# EasyEDA Pro project mbot_command_link.epro

# Schematic MBot_Wireless_Host_V1.1

## Sheets
1 MCU
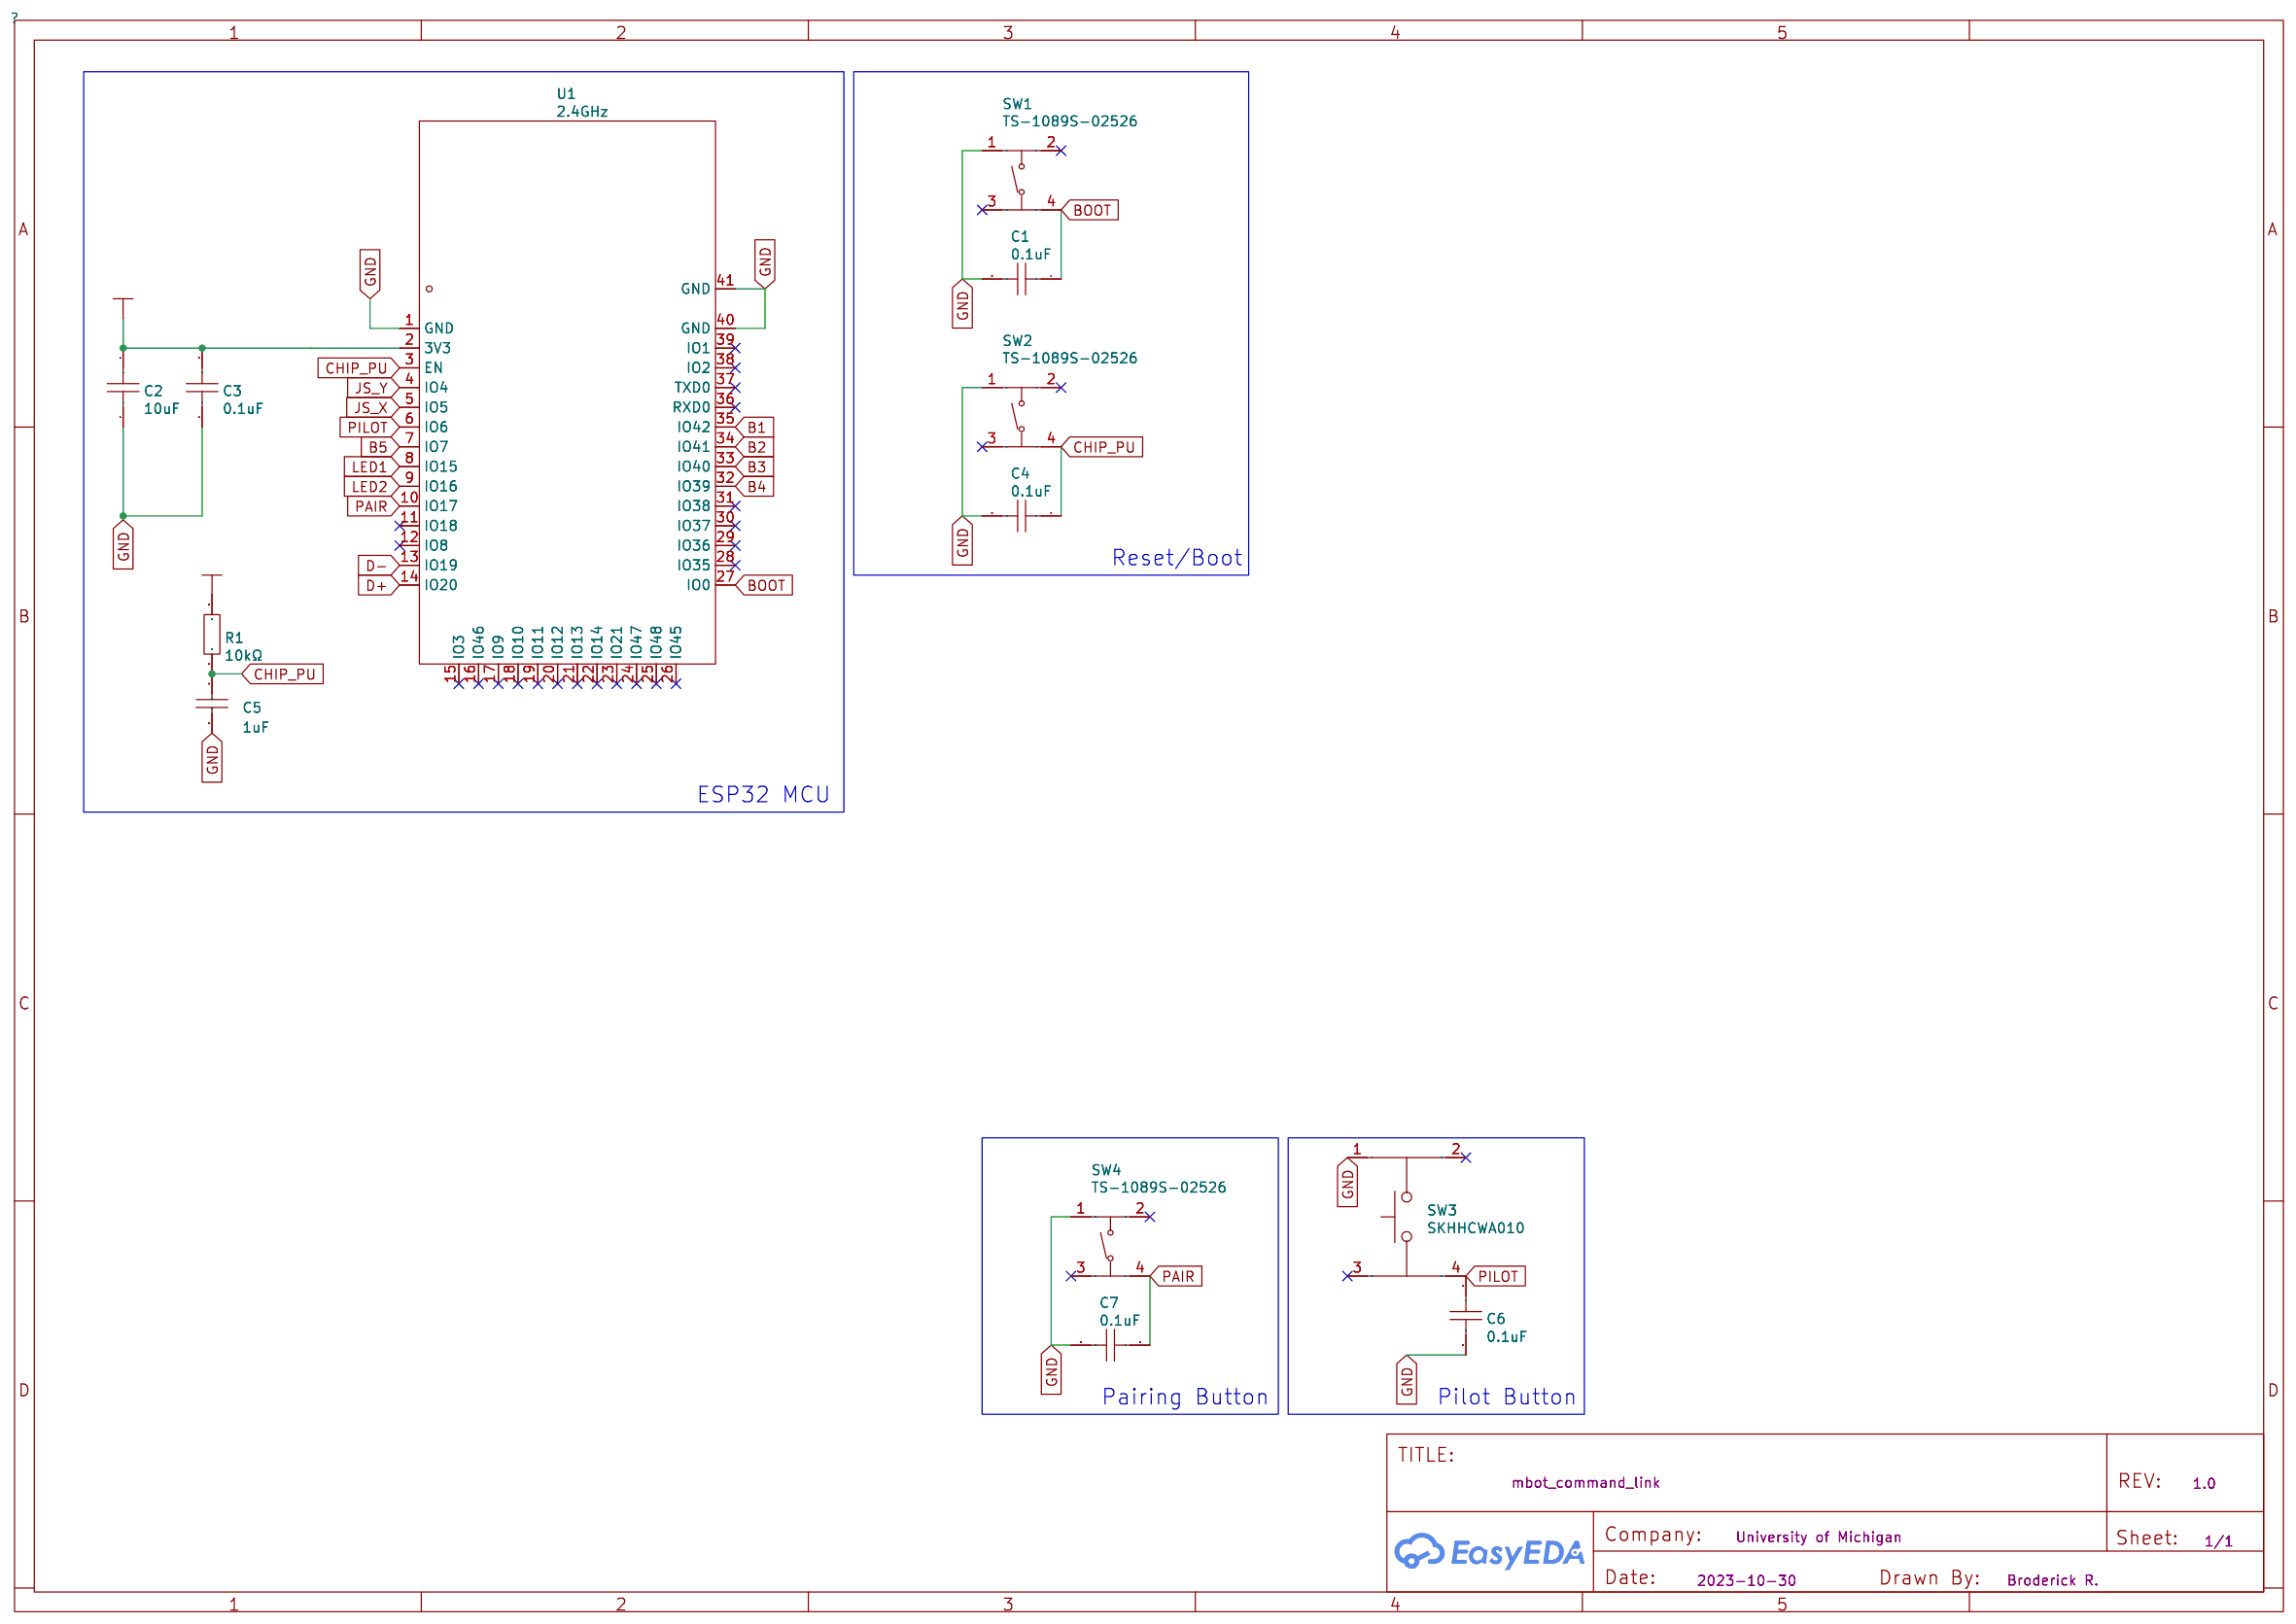
[diagram p0: MCU]
2 Power: Create Date: 2024-04-29; Page Name: Power; Project Name: MBot_Wireless_Host_V1.1_Pro; Schematic Name: MBot_Wireless_Host_V1.1; Update Date: 2024-04-29; Company: EasyEDA.com; Drawn: EasyEDA; Page Size: A4; Part Number: JLCPCB-002; Reviewed: EasyEDA; Version: V0.1
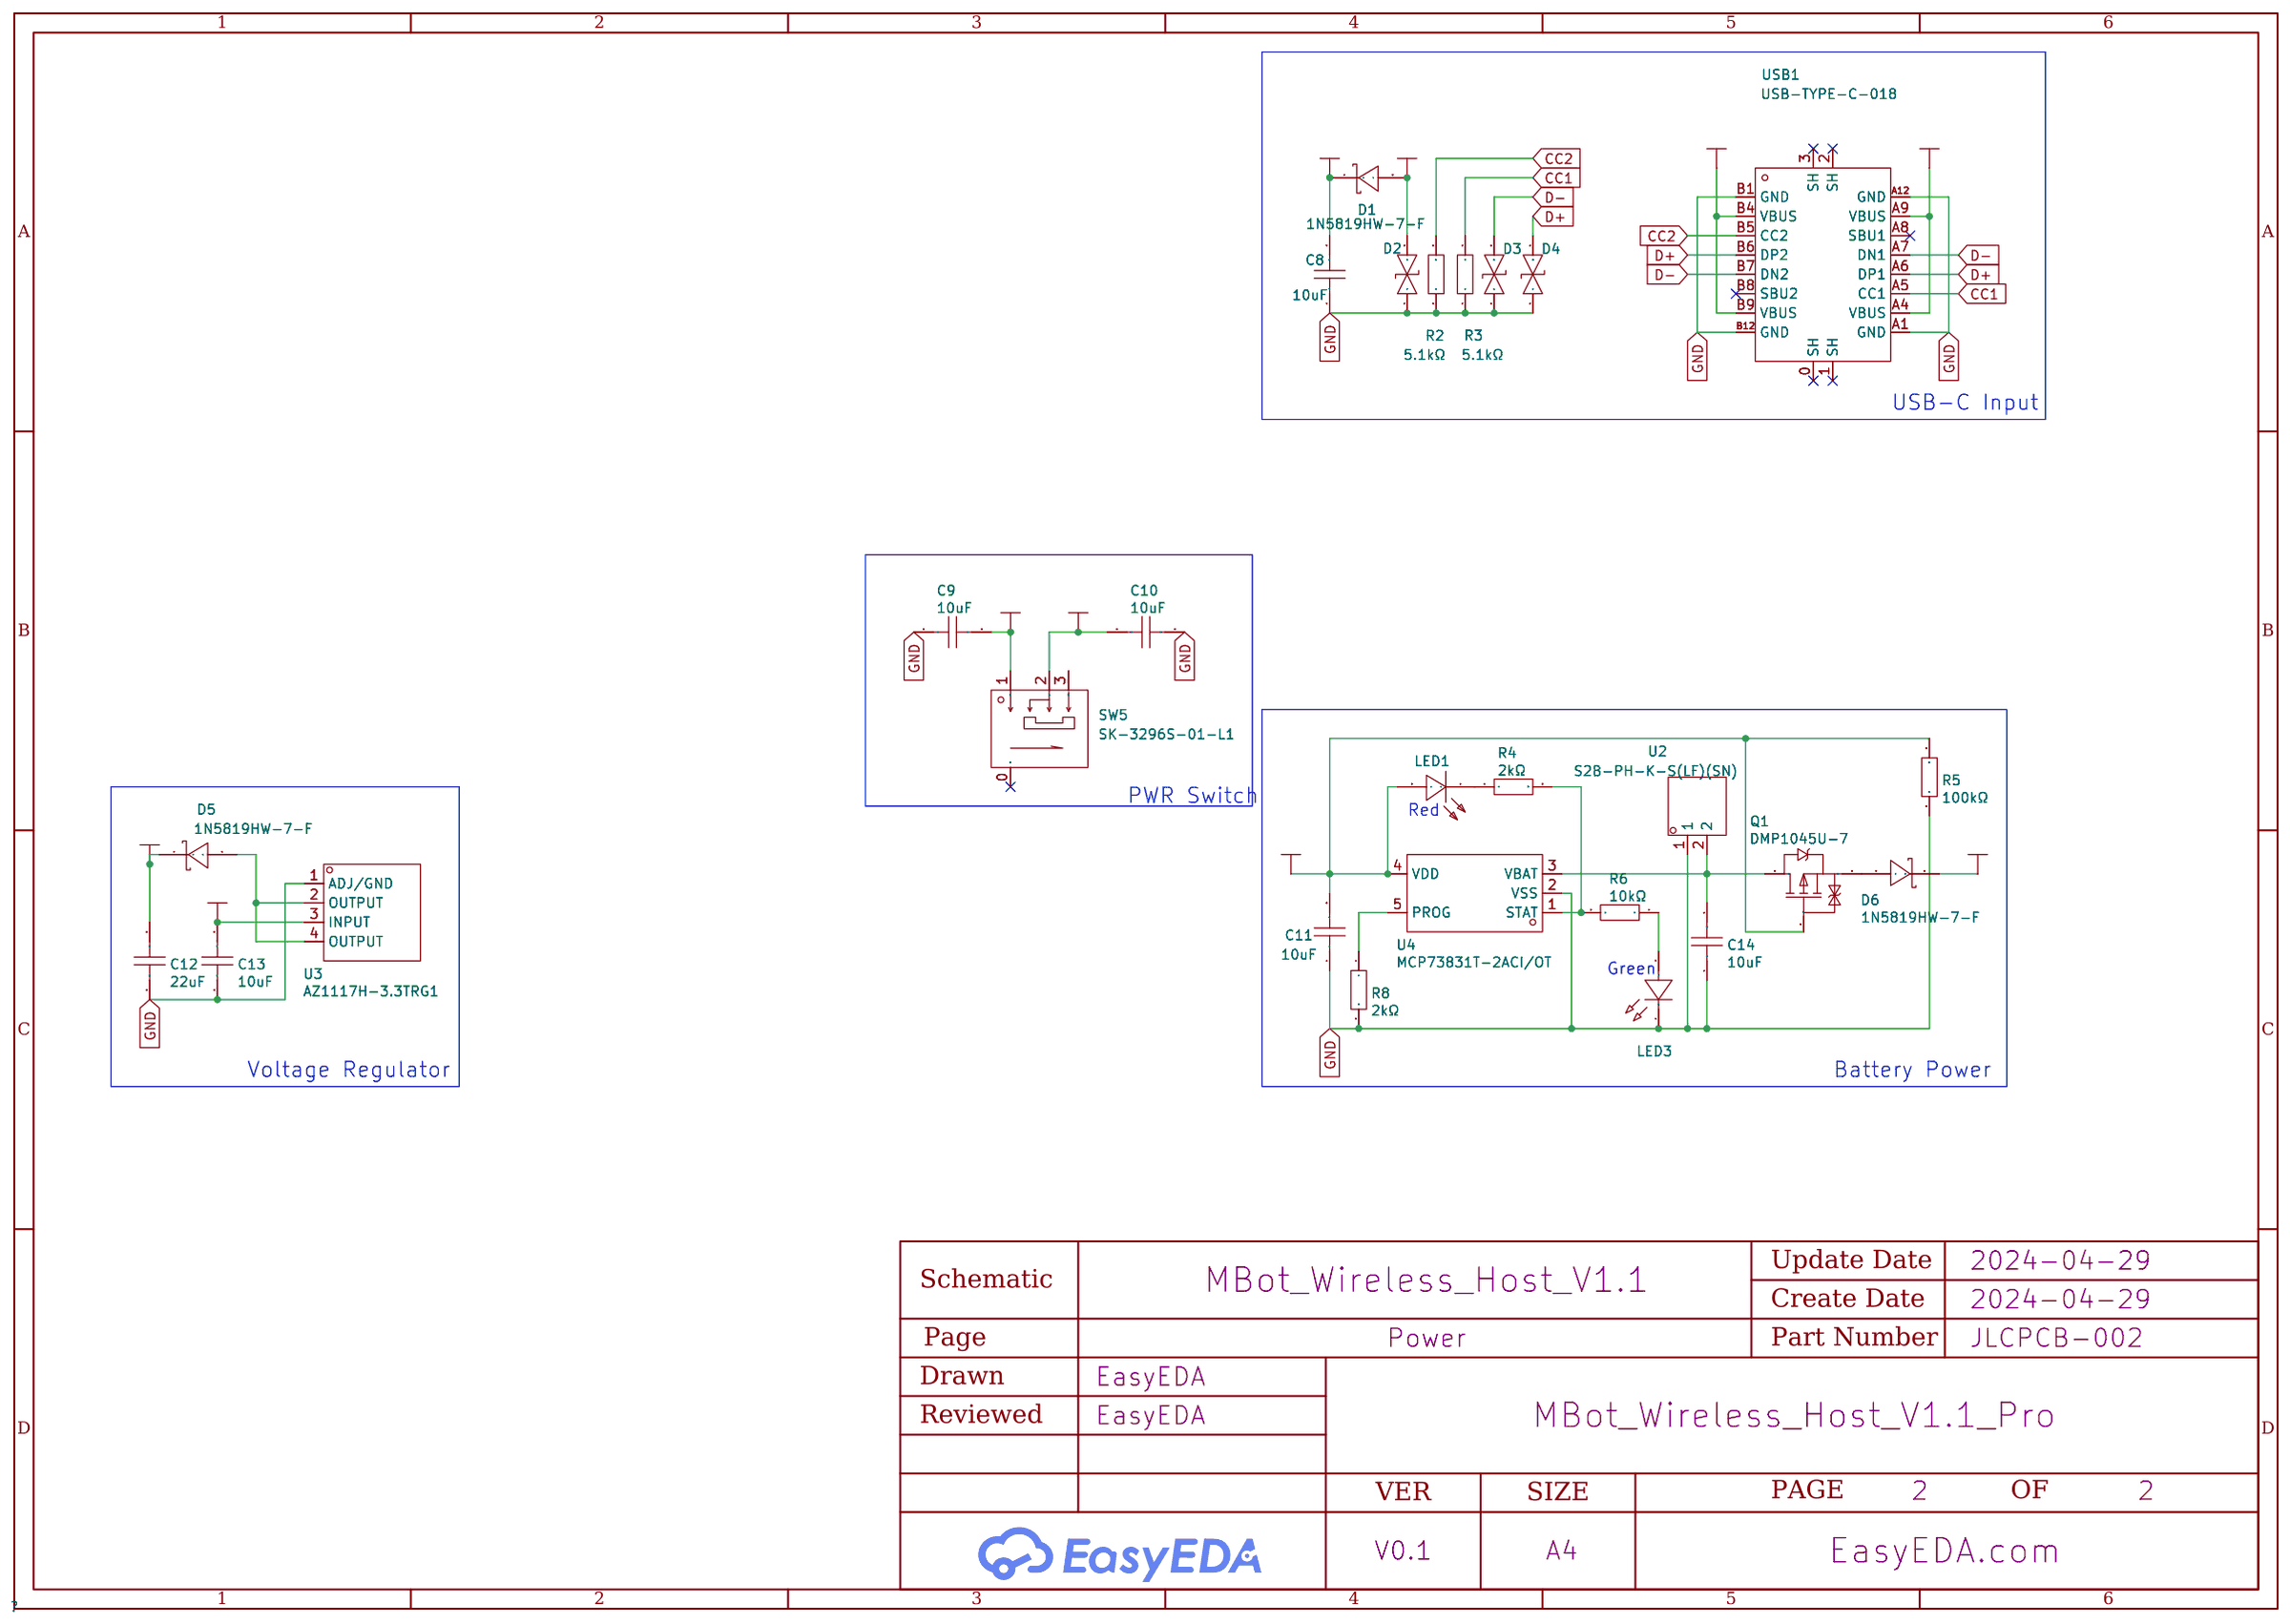
[diagram p1: Power]
3 UI: Create Date: 2024-04-29; Page Name: UI; Project Name: mbot_command_link; Schematic Name: MBot_Wireless_Host_V1.1; Update Date: 2024-05-23; Company: EasyEDA.com; Drawn: EasyEDA; Page Size: A4; Part Number: JLCPCB-002; Reviewed: EasyEDA; Version: V0.1
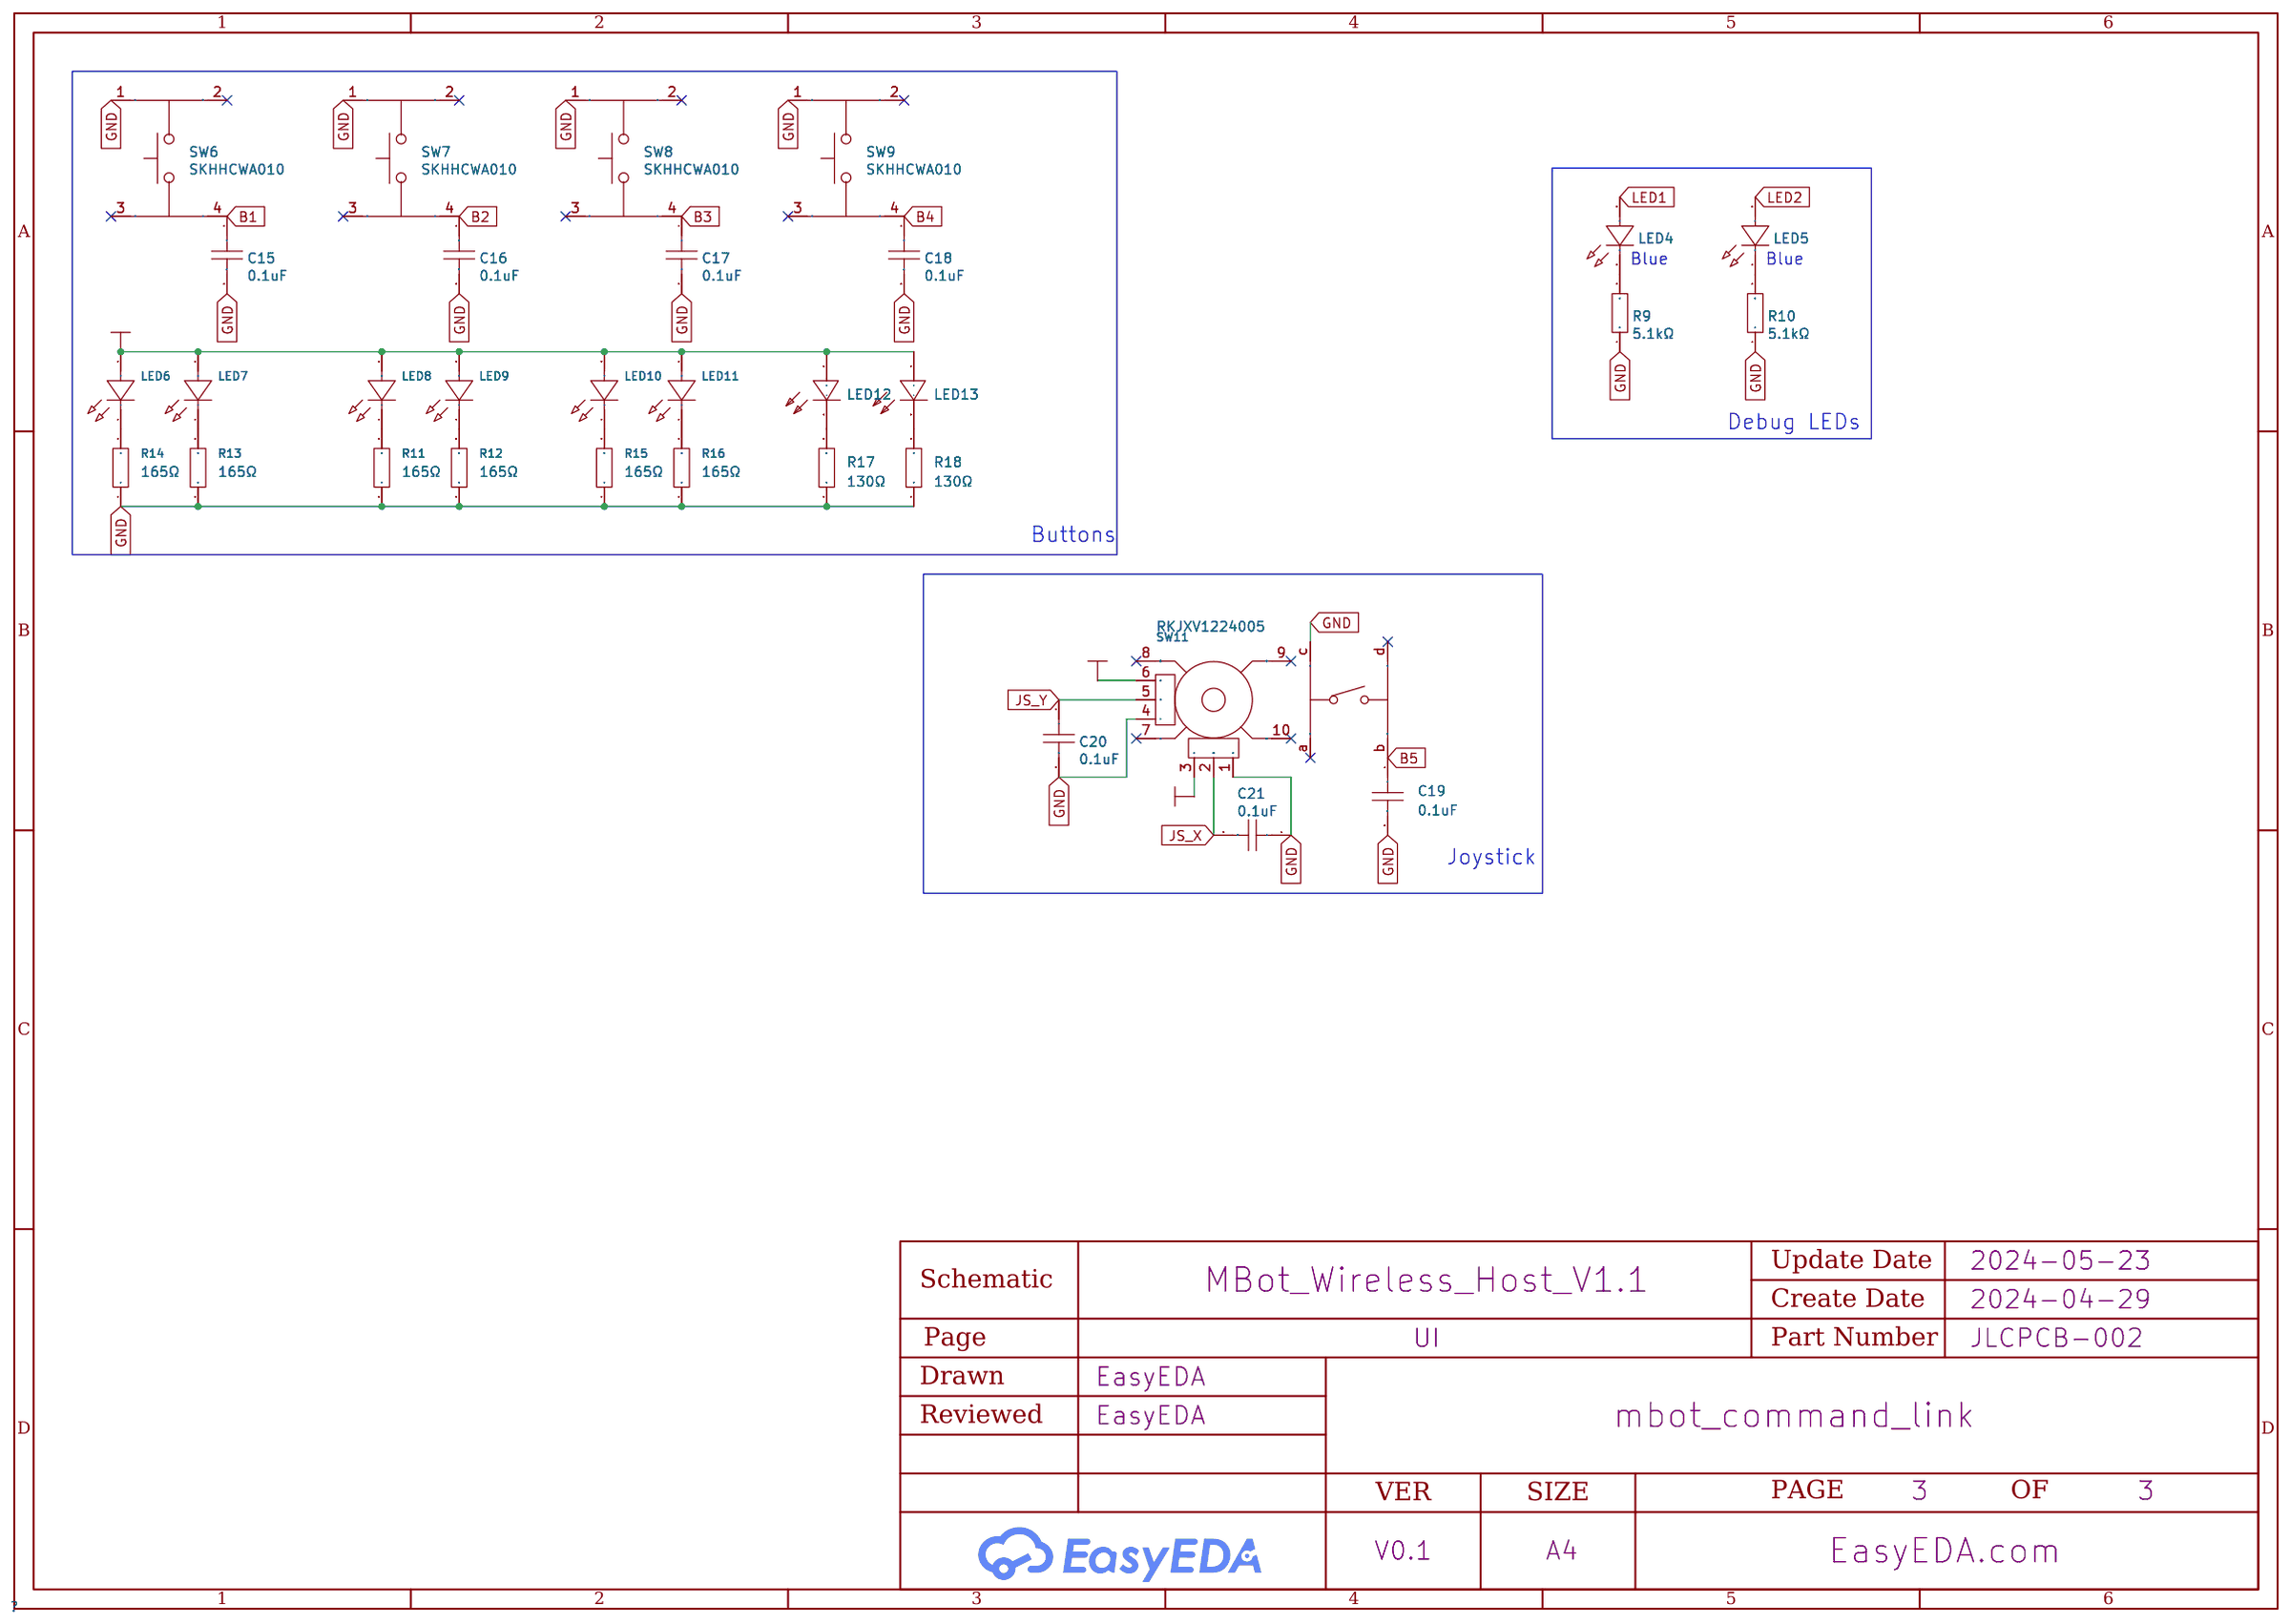
[diagram p2: UI]

## Parts
sheet MCU
C1  0.1uF  [footprint_52c0]
C2  10uF  [footprint_52c0]
C3  0.1uF  [footprint_52c0]
C4  0.1uF  [footprint_52c0]
C5  1uF  [C0603]
C6  0.1uF  [footprint_52c0]
C7  0.1uF  [footprint_52c0]
R1  10kΩ  [footprint_0432]
SW1  TS-1089S-02526  [footprint_4ab8]
SW2  TS-1089S-02526  [footprint_4ab8]
SW3  SKHHCWA010  [footprint_5a2e]
SW4  TS-1089S-02526  [footprint_4ab8]
U1  2.4GHz  [WIRELM-SMD_ESP32-S3-WROOM-1]
sheet Power
C8  10uF  [footprint_52c0]
C9  10uF  [footprint_52c0]
C10  10uF  [footprint_52c0]
C11  10uF  [footprint_52c0]
C12  22uF  [footprint_52c0]
C13  10uF  [footprint_52c0]
C14  10uF  [footprint_52c0]
D1  1N5819HW-7-F  [footprint_34dc]
D2  LESD5D5.0CT1G  [footprint_baa1]
D3  LESD5D5.0CT1G  [footprint_baa1]
D4  LESD5D5.0CT1G  [footprint_baa1]
D5  1N5819HW-7-F  [footprint_34dc]
D6  1N5819HW-7-F  [footprint_34dc]
LED1  KT-0603R  [footprint_1124]
LED3  XL-1608UGC-04  [footprint_5fac]
Q1  DMP1045U-7  [footprint_aab3]
R2  5.1kΩ  [footprint_0432]
R3  5.1kΩ  [footprint_0432]
R4  2kΩ  [footprint_0432]
R5  100kΩ  [footprint_0432]
R6  10kΩ  [footprint_0432]
R8  2kΩ  [footprint_0432]
SW5  SK-3296S-01-L1  [SW-SMD_3P-P1.50_L2.7-W6.6]
U2  S2B-PH-K-S(LF)(SN)  [footprint_2180]
U3  AZ1117H-3.3TRG1  [footprint_7102]
U4  MCP73831T-2ACI/OT  [footprint_d70e]
USB1  USB-TYPE-C-018  [footprint_530a]
sheet UI
C15  0.1uF  [footprint_52c0]
C16  0.1uF  [footprint_52c0]
C17  0.1uF  [footprint_52c0]
C18  0.1uF  [footprint_52c0]
C19  0.1uF  [footprint_52c0]
C20  0.1uF  [footprint_52c0]
C21  0.1uF  [footprint_52c0]
LED4  XL-1608UBC-04  [LED0603-RD_BLUE]
LED5  XL-1608UBC-04  [LED0603-RD_BLUE]
LED6  XL-1608UYC-06  [LED0603-RD-YELLOW]
LED7  XL-1608UYC-06  [LED0603-RD-YELLOW]
LED8  XL-1608SURC-06  [LED0603-RD_RED]
LED9  XL-1608SURC-06  [LED0603-RD_RED]
LED10  XL-1608UGC-04  [LED0603-RD_GREEN]
LED11  XL-1608UGC-04  [LED0603-RD_GREEN]
LED12  19-218/BHC-ZL1M2QY/3T  [LED0603-R-RD_BLUE]
LED13  19-218/BHC-ZL1M2QY/3T  [LED0603-R-RD_BLUE]
R9  5.1kΩ  [footprint_0432]
R10  5.1kΩ  [footprint_0432]
R11  165Ω  [R0603]
R12  165Ω  [R0603]
R13  165Ω  [R0603]
R14  165Ω  [R0603]
R15  165Ω  [R0603]
R16  165Ω  [R0603]
R17  130Ω  [R0603]
R18  130Ω  [R0603]
SW6  SKHHCWA010  [footprint_5a2e]
SW7  SKHHCWA010  [footprint_5a2e]
SW8  SKHHCWA010  [footprint_5a2e]
SW9  SKHHCWA010  [footprint_5a2e]
SW11  RKJXV1224005  [SW-TH_RKJXV1224005]

## Library data of the parts
C1 C3 C4 C6 C7 C15-C21 = 0.1uF: Supplier: LCSC; Manufacturer: YAGEO(国巨); Manufacturer Part: CC0603KRX7R9BB104; Supplier Part: C14663; JLCPCB Part Class: Basic Part; link: https://lcsc.com/eda_search?q=C14663&amp;%26type=1&amp;ref=editor
C2 C8-C11 C13 C14 = 10uF: Supplier: LCSC; Manufacturer: SAMSUNG(三星); Manufacturer Part: CL10A106KP8NNNC; Supplier Part: C19702; JLCPCB Part Class: Basic Part; link: https://lcsc.com/eda_search?q=C19702&amp;%26type=1&amp;ref=editor
C5 = CL10A105KO8NNNC: Capacitance: Tolerance:±10% Tolerance:±10% Voltage Rated: Temperature Coefficient:; LCSC Part Name: 1uF ±10% 16V; Supplier Part: C1592; Manufacturer: SAMSUNG(三星); Supplier Footprint: 0603; Datasheet: https://atta.szlcsc.com/upload/public/pdf/source/20220919/9FBE606BE0D9532D730F292EB26DC5BB.pdf; Supplier: LCSC; Tolerance: ±10%
R1 R6 = 10kΩ: Supplier: LCSC; Manufacturer: UNI-ROYAL(厚声); Manufacturer Part: 0603WAF1002T5E; Supplier Part: C25804; JLCPCB Part Class: Basic Part; link: https://lcsc.com/eda_search?q=C25804&amp;%26type=1&amp;ref=editor
SW1 SW2 SW4 = TS-1089S-02526: Supplier: LCSC; Supplier Part: C455282; Manufacturer: XUNPU(讯普); JLCPCB Part Class: Extended Part
SW3 SW6-SW9 = SKHHCWA010: Supplier: LCSC; Supplier Part: C139761; Manufacturer: ALPSALPINE(阿尔卑斯阿尔派); JLCPCB Part Class: Extended Part; link: https://lcsc.com/eda_search?q=C139761&amp;%26type=1&amp;ref=editor
U1 = ESP32-S3-WROOM-1-N8R2: Core Processor:ESP32-S3芯片 Support Interface:I2C；GPIO；SPI；PWM；ADC；UART；USB；I2S Frequency:2.4GHz; LCSC Part Name: 通用型Wi-Fi+低功耗蓝牙MCU模组; Supplier Part: C2913204; Manufacturer: ESPRESSIF(乐鑫); Supplier Footprint: SMD,18x25.5mm; JLCPCB Part Class: Extended Part; Datasheet: https://atta.szlcsc.com/upload/public/pdf/source/20220628/A2AC12B3C87735CAEB7EBE2DBE80936C.pdf; Supplier: LCSC; Core Processor: ESP32-S3芯片; Support Interface: I2C；GPIO；SPI；PWM；ADC；UART；USB；I2S
C12 = 22uF: Supplier: LCSC; Manufacturer: SAMSUNG(三星); Manufacturer Part: CL10A226MQ8NRNC; Supplier Part: C59461; JLCPCB Part Class: Basic Part; link: https://lcsc.com/eda_search?q=C59461&amp;%26type=1&amp;ref=editor
D1 D5 D6 = 1N5819HW-7-F: Supplier: LCSC; Manufacturer: DIODES(美台); Supplier Part: C82544; JLCPCB Part Class: Extended Part; link: https://lcsc.com/eda_search?q=C82544&amp;%26type=1&amp;ref=editor
D2-D4 = LESD5D5.0CT1G: Supplier: LCSC; Supplier Part: C383211; Manufacturer: LRC(乐山无线电); JLCPCB Part Class: Extended Part; link: https://lcsc.com/eda_search?q=C383211&amp;%26type=1&amp;ref=editor
LED1 = KT-0603R: Supplier: LCSC; Manufacturer: KENTO; Supplier Part: C2286; JLCPCB Part Class: Basic Part; link: https://lcsc.com/eda_search?q=C2286&amp;%26type=1&amp;ref=editor
LED3 = XL-1608UGC-04: Supplier: LCSC; Supplier Part: C965804; Manufacturer: XINGLIGHT(成兴光); JLCPCB Part Class: Extended Part
Q1 = DMP1045U-7: Supplier: LCSC; Supplier Part: C177033; Manufacturer: DIODES(美台); JLCPCB Part Class: Extended Part; link: https://lcsc.com/eda_search?q=C177033&amp;%26type=1&amp;ref=editor
R2 R3 R9 R10 = 5.1kΩ: Supplier: LCSC; Manufacturer Part: 0603WAF5101T5E; Manufacturer: UNI-ROYAL(厚声); Supplier Part: C23186; JLCPCB Part Class: Basic Part; link: https://lcsc.com/eda_search?q=C23186&amp;%26type=1&amp;ref=editor
R4 R8 = 2kΩ: Supplier: LCSC; Manufacturer: UNI-ROYAL(厚声); Manufacturer Part: 0603WAF2001T5E; Supplier Part: C22975; JLCPCB Part Class: Basic Part; link: https://lcsc.com/eda_search?q=C22975&amp;%26type=1&amp;ref=editor
R5 = 100kΩ: Supplier: LCSC; Manufacturer: UNI-ROYAL(厚声); Manufacturer Part: 0603WAF1003T5E; Supplier Part: C25803; JLCPCB Part Class: Basic Part; link: https://lcsc.com/eda_search?q=C25803&amp;%26type=1&amp;ref=editor
SW5 = SK-3296S-01-L1: Circuit:SPDT Actuator Style:Rectangular columnar Pin Style:SMDSplicing Switch Length:7.8mm Switch Width:2.75mm Switch Height:1.35mm Mounting Style:卧贴 Actuator Color:Black Current Rating (DC):50mA Voltage Rating (DC):12V Current Rating (AC):50mA Voltage Ra; LCSC Part Name: 柄长1.5mm 卧贴双档 滑动开关; Supplier Part: C319020; Manufacturer: XKB Connectivity(中国星坤); Supplier Footprint: SMD; Datasheet: https://atta.szlcsc.com/upload/public/pdf/source/20211011/33977E7F5E3AE40A3E3DC6795807E20F.pdf; Supplier: LCSC; Circuit: SPDT; Actuator Style: Rectangular columnar; Pin Style: SMDSplicing; Switch Length: 7.8mm; Switch Width: 2.75mm; Switch Height: 1.35mm; Mounting Style: 卧贴; Actuator Color: Black; Current Rating (DC): 50mA; Voltage Rating (DC): 12V; Current Rating (AC): 50mA; Voltage Rating (AC): 12V; Mechanical Life: 1万次; Operating Temperature: -40℃~+85℃
U2 = S2B-PH-K-S(LF)(SN): Supplier: LCSC; Supplier Part: C173752; Manufacturer: JST; JLCPCB Part Class: Extended Part; link: https://lcsc.com/eda_search?q=C173752&amp;%26type=1&amp;ref=editor
U3 = AZ1117H-3.3TRG1: Supplier: LCSC; Manufacturer: DIODES(美台); Supplier Part: C110474; JLCPCB Part Class: Extended Part; link: https://lcsc.com/eda_search?q=C110474&amp;%26type=1&amp;ref=editor
U4 = MCP73831T-2ACI/OT: Supplier: LCSC; Supplier Part: C424093; Manufacturer: MICROCHIP(美国微芯); JLCPCB Part Class: Extended Part; link: https://lcsc.com/eda_search?q=C424093&amp;%26type=1&amp;ref=editor
USB1 = USB-TYPE-C-018: Supplier: LCSC; Supplier Part: C2927038; Manufacturer: DEALON(德艺隆); JLCPCB Part Class: Extended Part; link: https://lcsc.com/eda_search?q=C2927038&amp;%26type=1&amp;ref=editor
LED4 LED5 = XL-1608UBC-04: Emitted Color:Blue Power Dissipation:80mW Forward Current:25mA Dominant Wavelength:460nm~469nm Dominant Wavelength:460nm~469nm Peak Wavelength:475nm Lens Color:无色透明透镜 Color Temperature:- Color Temperature:- Viewing Angle:120° Mounting Sytle:Positive post; Supplier Part: C965807; Manufacturer: XINGLIGHT(成兴光); Supplier Footprint: 0603; JLCPCB Part Class: Extended Part; Datasheet: https://atta.szlcsc.com/upload/public/pdf/source/20240218/F76B043D1CDACE9DB8357580572EF0D5.pdf; Supplier: LCSC; Emitted Color: Blue; Power Dissipation: 80mW; Forward Current: 25mA; Dominant Wavelength: 460nm~469nm; Peak Wavelength: 475nm; Lens Color: 无色透明透镜; Viewing Angle: 120°; Mounting Sytle: Positive post; Operating Temperature: -30℃~+85℃
LED6 LED7 = XL-1608UYC-06: Emitted Color:Yellow Power Dissipation:55mW Forward Current:25mA Dominant Wavelength:589nm~591nm Dominant Wavelength:589nm~591nm Peak Wavelength:593nm Lens Color:无色透明透镜 Color Temperature:- Color Temperature:- Viewing Angle:120° Mounting Sytle:Positive pos; Supplier Part: C965802; Manufacturer: XINGLIGHT(成兴光); Supplier Footprint: 0603; Datasheet: https://atta.szlcsc.com/upload/public/pdf/source/20221102/26ABBA3E6ACD61FD929A9AD43D76D738.pdf; Supplier: LCSC; Emitted Color: Yellow; Power Dissipation: 55mW; Forward Current: 25mA; Dominant Wavelength: 589nm~591nm; Peak Wavelength: 593nm; Lens Color: 无色透明透镜; Viewing Angle: 120°; Mounting Sytle: Positive post; Operating Temperature: -30℃~+85℃
LED8 LED9 = XL-1608SURC-06: Emitted Color:Red Power Dissipation:55mW Forward Current:25mA Dominant Wavelength:617nm~621nm Dominant Wavelength:617nm~621nm Peak Wavelength:623nm Lens Color:无色透明透镜 Color Temperature:- Color Temperature:- Viewing Angle:120° Mounting Sytle:Positive post O; Supplier Part: C965799; Manufacturer: XINGLIGHT(成兴光); Supplier Footprint: 0603; Datasheet: https://atta.szlcsc.com/upload/public/pdf/source/20221102/D860AFDD1CDB02C5A8064103A32707E2.pdf; Supplier: LCSC; Emitted Color: Red; Power Dissipation: 55mW; Forward Current: 25mA; Dominant Wavelength: 617nm~621nm; Peak Wavelength: 623nm; Lens Color: 无色透明透镜; Viewing Angle: 120°; Mounting Sytle: Positive post; Operating Temperature: -30℃~+85℃
LED10 LED11 = XL-1608UGC-04: Lamp Holder Type:- Emitted Color:Emerald Forward Voltage (VF):- Forward Voltage (VF):- Power Dissipation:80mW Forward Current:25mA Dominant Wavelength:516nm~525nm Dominant Wavelength:516nm~525nm Peak Wavelength:534nm Diode Configuration:独立二极管 Lens Color:无; Supplier Part: C965804; Manufacturer: XINGLIGHT(成兴光); Supplier Footprint: 0603; Datasheet: https://atta.szlcsc.com/upload/public/pdf/source/20221102/520D6E465E5CFD1609C8A4DBC80D4018.pdf; Supplier: LCSC; Emitted Color: Emerald; Power Dissipation: 80mW; Forward Current: 25mA; Dominant Wavelength: 516nm~525nm; Peak Wavelength: 534nm; Diode Configuration: 独立二极管; Lens Color: 无色透明透镜; Viewing Angle: 120°; Mounting Sytle: Positive post; Operating Temperature: -30℃~+85℃
LED12 LED13 = 19-218/BHC-ZL1M2QY/3T: Emitted Color:Blue Forward Voltage (VF):2.95V Forward Voltage (VF):2.95V Forward Current:5mA Dominant Wavelength:470nm Dominant Wavelength:470nm Peak Wavelength:468nm Lens Color:无色透明透镜 Luminous Intensity:20mcd Luminous Intensity:20mcd Viewing Angle:120°; LCSC Part Name: 蓝灯; Supplier Part: C264488; Manufacturer: EVERLIGHT(亿光); Supplier Footprint: 0603; JLCPCB Part Class: Extended Part; Datasheet: https://atta.szlcsc.com/upload/public/pdf/source/20180817/C264488_D2D59D0FD90AC053F04FE3191E733FCE.pdf; Supplier: LCSC; Emitted Color: Blue; Forward Voltage (VF): 2.95V; Forward Current: 5mA; Dominant Wavelength: 470nm; Peak Wavelength: 468nm; Lens Color: 无色透明透镜; Luminous Intensity: 20mcd; Viewing Angle: 120°
R11-R16 = 0603WAF1650T5E: Type:Thick Film Resistors Resistance: Tolerance:±1% Tolerance:±1% Power(Watts): Overload Voltage (Max): Temperature Coefficient:±100ppm/℃ Temperature Coefficient:±100ppm/℃ Operating Temperature Range:-55℃~+155℃ Operating Temperature Range:-55℃~+155℃; LCSC Part Name: 165Ω ±1% 100mW 厚膜电阻; Supplier Part: C22888; Manufacturer: UNI-ROYAL(厚声); Supplier Footprint: 0603; Datasheet: https://atta.szlcsc.com/upload/public/pdf/source/20200306/C422600_1E6D84923E4A46A82E41ADD87F860B5C.pdf; Supplier: LCSC; Type: Thick Film Resistors; Tolerance: ±1%; Temperature Coefficient: ±100ppm/℃; Operating Temperature Range: -55℃~+155℃
R17 R18 = 0603WAF1300T5E: Type:Thick Film Resistors Resistance: Tolerance:±1% Tolerance:±1% Power(Watts): Overload Voltage (Max): Temperature Coefficient:±100ppm/℃ Temperature Coefficient:±100ppm/℃ Operating Temperature Range:-55℃~+155℃ Operating Temperature Range:-55℃~+155℃; LCSC Part Name: 130Ω ±1% 100mW 厚膜电阻; Supplier Part: C22796; Manufacturer: UNI-ROYAL(厚声); Supplier Footprint: 0603; Datasheet: https://atta.szlcsc.com/upload/public/pdf/source/20200306/C422600_1E6D84923E4A46A82E41ADD87F860B5C.pdf; Supplier: LCSC; Type: Thick Film Resistors; Tolerance: ±1%; Temperature Coefficient: ±100ppm/℃; Operating Temperature Range: -55℃~+155℃
SW11 = RKJXV1224005: Supplier Part: C146170; Manufacturer: ALPSALPINE(阿尔卑斯阿尔派); Supplier Footprint: 插件,13x13mm; JLCPCB Part Class: Extended Part; Datasheet: https://atta.szlcsc.com/upload/public/pdf/source/20180125/C146170_15168615510911301620.pdf; Supplier: LCSC

## Nets
3V3: C2.2 C3.2 C12.2 D5.1(K) LED6.2(A) LED7.2(A) LED8.2(A) LED9.2(A) LED10.2(A) LED11.2(A) LED12.1(+) LED13.1(+) R1.2 SW11.3(A) SW11.6(B) U1.2(3V3)
GND: C1.2 C2.1 C3.1 C4.2 C5.1 C6.2 C7.2 C8.1 C9.1 C10.1 C11.1 C12.1 C13.1 C14.1 C15.2 C16.2 C17.2 C18.2 C19.2 C20.2 C21.1 D2.1 D3.1 D4.1 LED3.1(K) R2.1 R3.1 R5.1 R8.2 R9.1 R10.1 R11.1 R12.1 R13.1 R14.1 R15.1 R16.1 R17.1 R18.1 SW1.1 SW2.1 SW3.1 SW4.1 SW6.1 SW7.1 SW8.1 SW9.1 SW11.1(B) SW11.4(A) SW11.c U1.1(GND) U1.40(GND) U1.41(GND) U2.1 U3.1(ADJ/GND) U4.2(VSS) USB1.A1(GND) USB1.A12(GND) USB1.B1(GND) USB1.B12(GND)
VBAT: C9.2 D6.1(K) SW5.1
VBUS: C11.2 D1.2(A) D2.2 LED1.2(A) Q1.1(G) R5.2 U4.4(VDD) USB1.A4(VBUS) USB1.A9(VBUS) USB1.B4(VBUS) USB1.B9(VBUS)
VCC_5V: C8.2 C10.2 C13.2 D1.1(K) SW5.2 U3.3(INPUT)
B1: C15.1 SW6.4 U1.35(IO42)
B2: C16.1 SW7.4 U1.34(IO41)
B3: C17.1 SW8.4 U1.33(IO40)
B4: C18.1 SW9.4 U1.32(IO39)
B5: C19.1 SW11.b U1.7(IO7)
BOOT: C1.1 SW1.4 U1.27(IO0)
CC1: R3.2 USB1.A5(CC1)
CC2: R2.2 USB1.B5(CC2)
CHIP_PU: C4.1 C5.2 R1.1 SW2.4 U1.3(EN)
D+: D4.2 U1.14(IO20) USB1.A6(DP1) USB1.B6(DP2)
D-: D3.2 U1.13(IO19) USB1.A7(DN1) USB1.B7(DN2)
JS_X: C21.2 SW11.2(DTA) U1.5(IO5)
JS_Y: C20.1 SW11.5(DTA) U1.4(IO4)
LED1: LED4.2(A) U1.8(IO15)
LED2: LED5.2(A) U1.9(IO16)
PAIR: C7.1 SW4.4 U1.10(IO17)
PILOT: C6.1 SW3.4 U1.6(IO6)
$2N1130: R8.1 U4.5(PROG)
$2N1131: R4.2 R6.2 U4.1(STAT)
$2N1132: C14.2 Q1.3(D) U2.2 U4.3(VBAT)
$2N1133: LED3.2(A) R6.1
$2N1135: LED1.1(K) R4.1
$2N1136: D6.2(A) Q1.2(S)
$2N1158: D5.2(A) U3.2(OUTPUT) U3.4(OUTPUT)
$3N1382: LED4.1(K) R9.2
$3N1428: LED5.1(K) R10.2
$3N3146: LED8.1(K) R11.2
$3N3185: LED9.1(K) R12.2
$3N3261: LED7.1(K) R13.2
$3N3300: LED6.1(K) R14.2
$3N3339: LED10.1(K) R15.2
$3N3378: LED11.1(K) R16.2
$3N3417: LED12.2(-) R17.2
$3N3456: LED13.2(-) R18.2

Not connected (* = marked no-connect by the designer): SW1 2* 3*; SW2 2* 3*; SW3 2* 3*; SW4 2* 3*; SW5 0* 3; SW6 2* 3*; SW7 2* 3*; SW8 2* 3*; SW9 2* 3*; SW11 7(GND)* 8(GND)* 9(GND)* 10(GND)* a* d*; U1 11(IO18)* 12(IO8)* 15(IO3)* 16(IO46)* 17(IO9)* 18(IO10)* 19(IO11)* 20(IO12)* 21(IO13)* 22(IO14)* 23(IO21)* 24(IO47)* 25(IO48)* 26(IO45)* 28(IO35)* 29(IO36)* 30(IO37)* 31(IO38)* 36(RXD0)* 37(TXD0)* 38(IO2)* 39(IO1)*; USB1 0(SH)* 1(SH)* 2(SH)* 3(SH)* A8(SBU1)* B8(SBU2)*

## Notes on the sheets
sheet 1
- Reset/Boot
- ESP32 MCU
- Pairing Button
- Pilot Button
sheet 2
- USB-C Input
- PWR Switch
- Red
- Green
- Voltage Regulator
- Battery Power
sheet 3
- Blue
- Blue
- Debug LEDs
- Buttons
- Joystick

# Board PCB_MBot_Wireless_Host
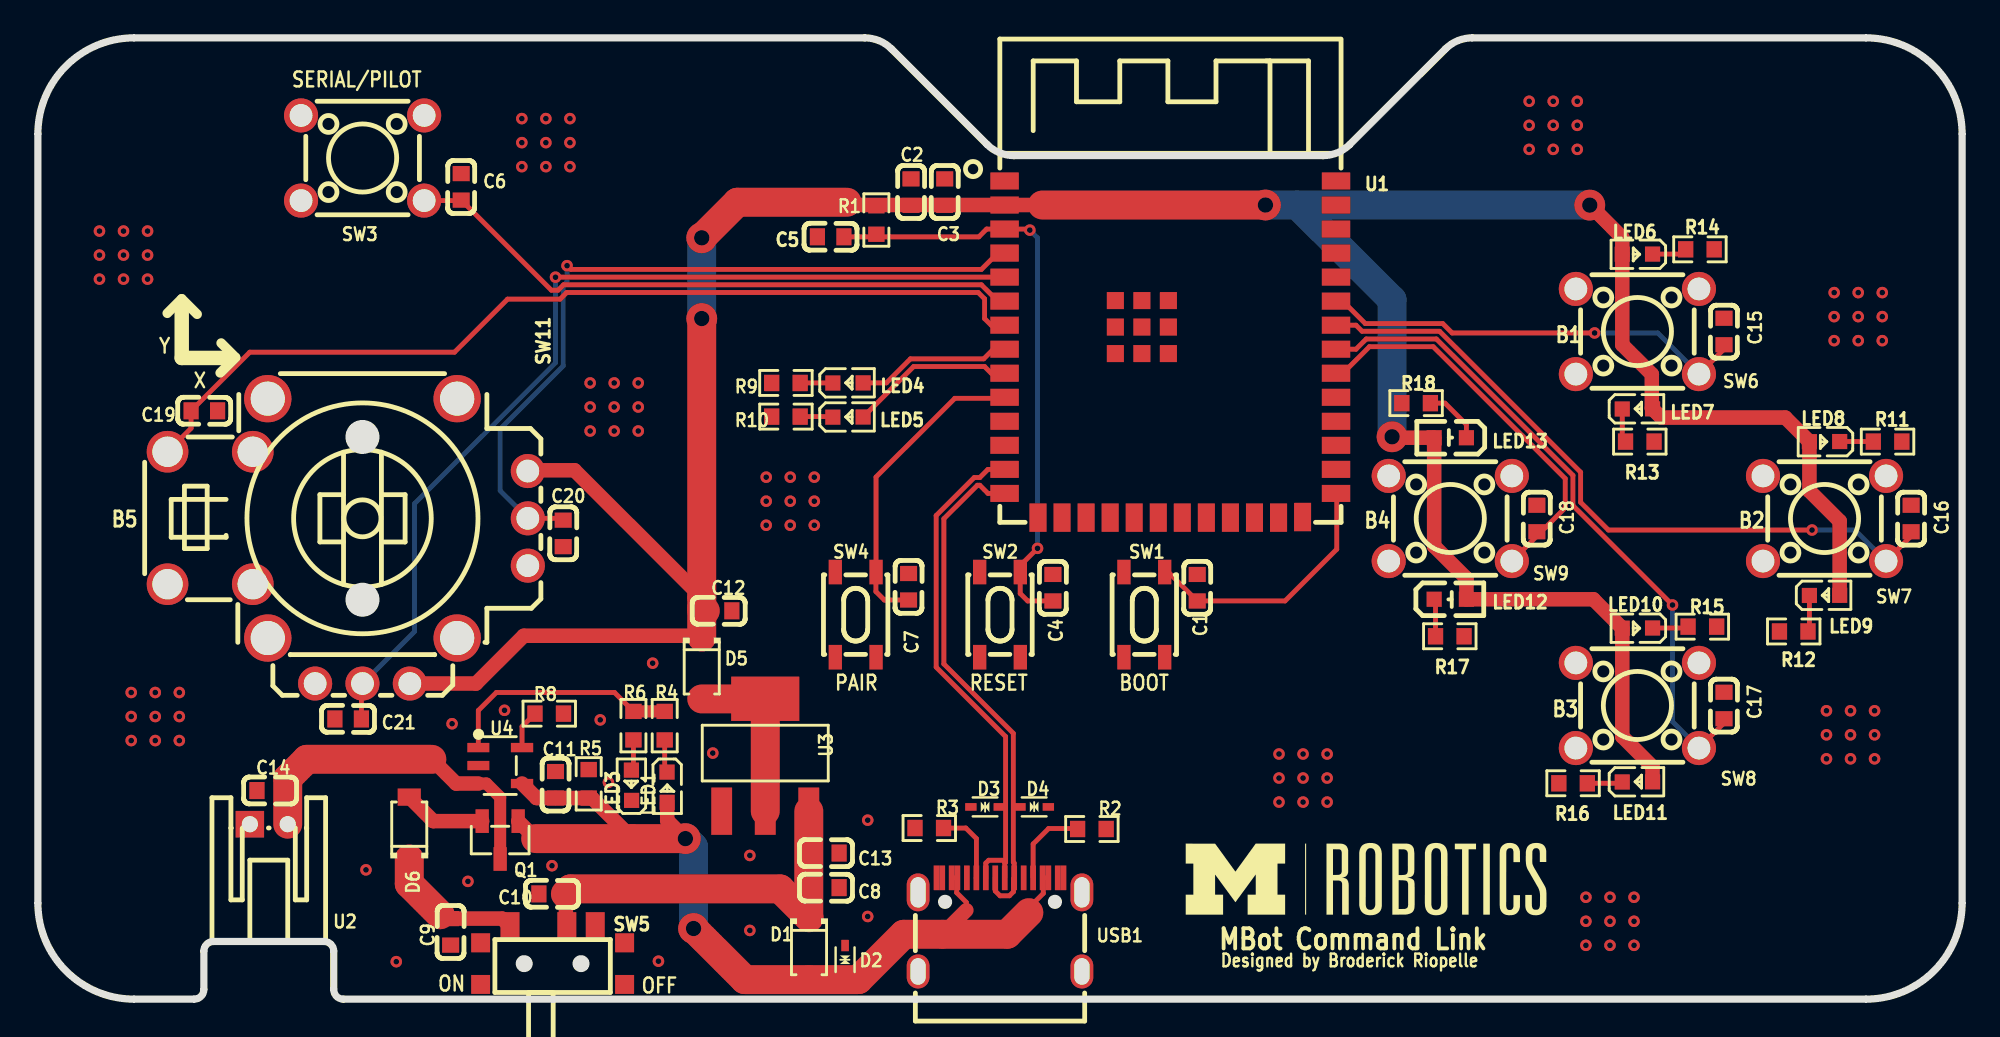
[diagram p3: board, top side]
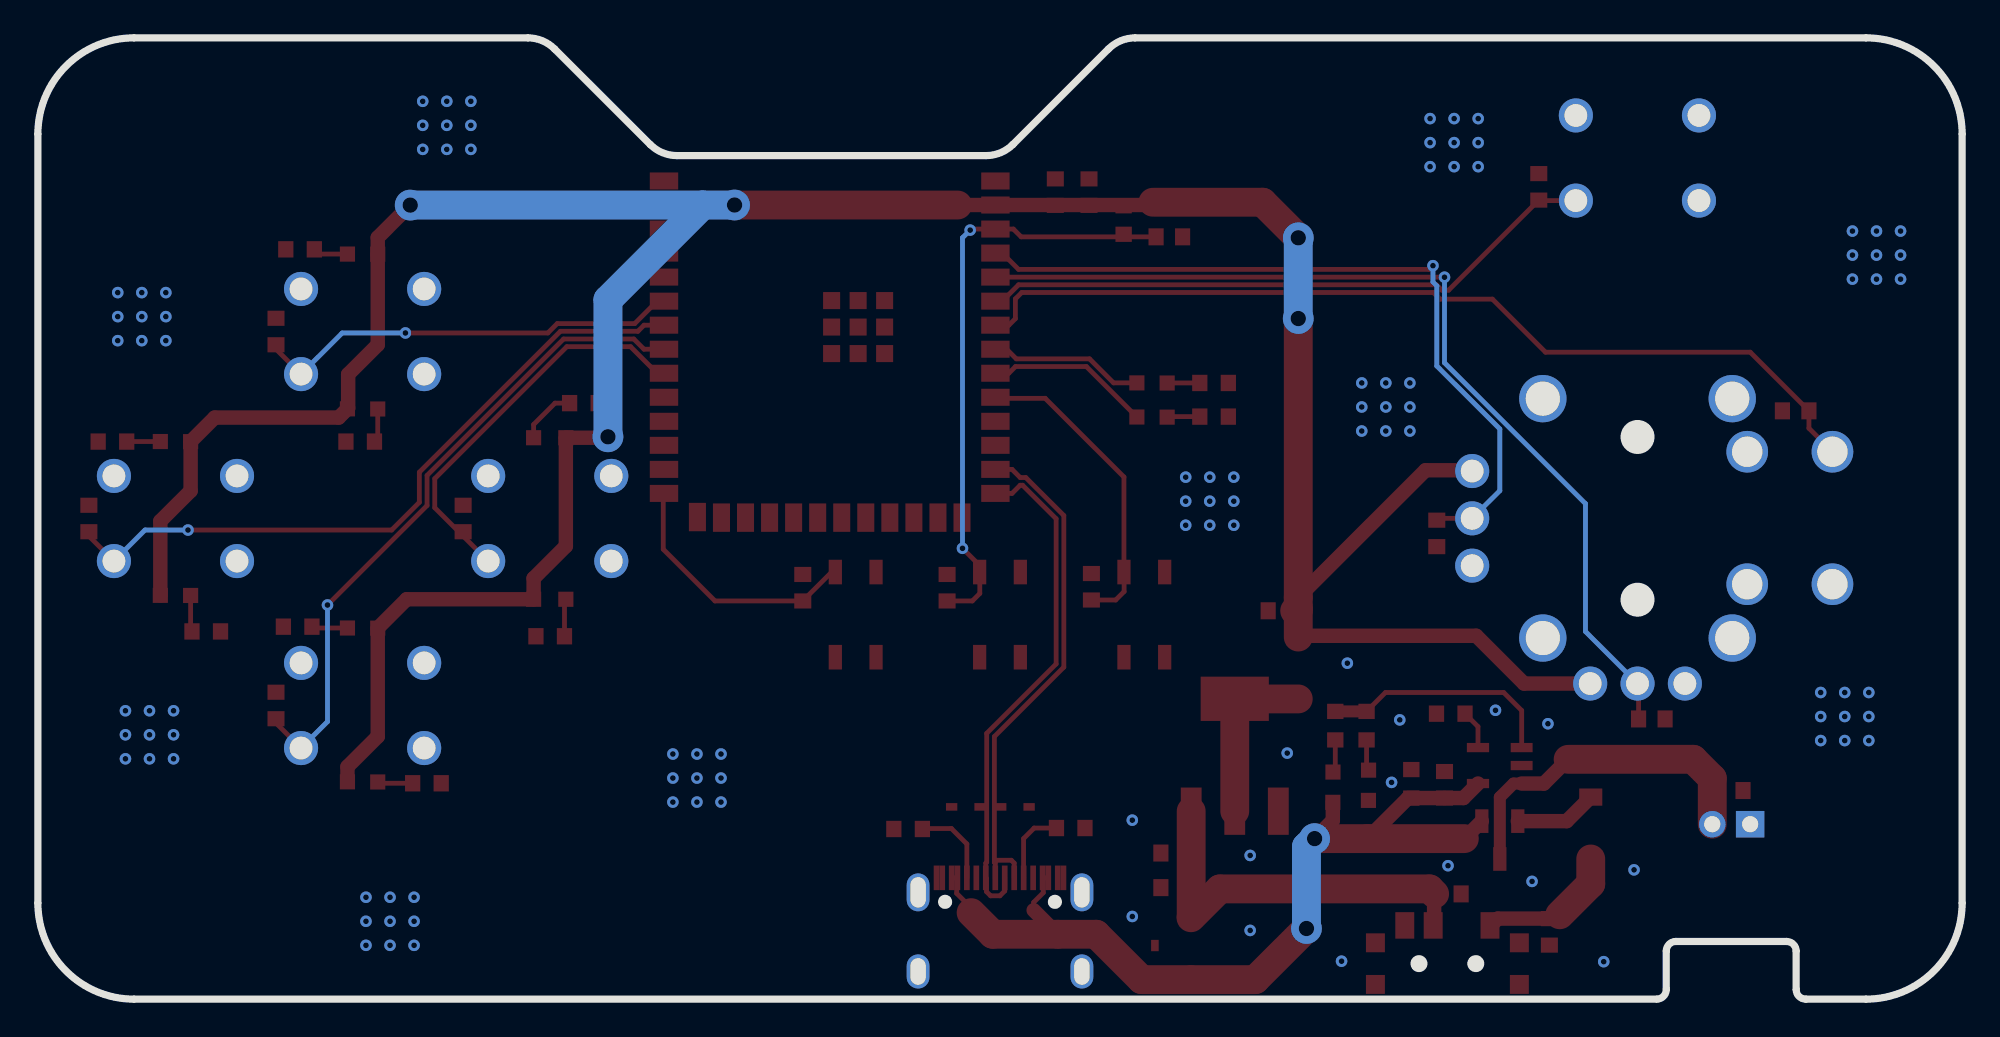
[diagram p4: board, bottom side, seen from below]

Outline 101.6 x 50.8 mm; copper layers: Top Layer, Bottom Layer. Coordinates in mm from the lower left corner of the outline.
Outline path: 0,45.72 arc(1.49,49.31) 5.08,50.8 43.66,50.8 arc(44.42,50.65) 45.07,50.21 50.12,45.16 arc(50.77,44.73) 51.54,44.58 67.85,44.58 arc(68.62,44.73) 69.27,45.16 74.32,50.21 arc(74.97,50.65) 75.73,50.8 96.52,50.8 arc(100.11,49.31) 101.6,45.72 101.6,5.08 arc(100.11,1.49) 96.52,0 16.13,0 arc(15.77,0.15) 15.62,0.51 15.62,2.54 arc(15.47,2.9) 15.11,3.05 9.27,3.05 arc(8.91,2.9) 8.76,2.54 8.76,0.51 arc(8.61,0.15) 8.25,0 5.08,0 arc(1.49,1.49) 0,5.08 0,45.72
Stack: Top Layer 0.035mm / Dielectric1 1.51mm FR4 er 4.5 / Bottom Layer 0.035mm

## Design rules (mm)
net D-: DP1
net D+: DP1
spacing Default (default): track to track 0.152, other pairs 0 to 0.152
track width Default (default): min 0.254, default 0.254, max 25.4
differential pair differentialPair (default): width min 0.127, default 0.254, max 2.54; gap min 0.152, default 0.152
via Default (default): diameter min 0.61, default 0.61, max 100.025; hole min 0.305, default 0.305, max 59.995
net GND uses gge27694

## Placement (name value [footprint] x y rotation side)
C1  0.1uF  [footprint_52c0]  61.21 21.74 90 top
C2  10uF  [footprint_52c0]  46.1 42.65 270 top
C3  0.1uF  [footprint_52c0]  47.88 42.65 270 top
C4  0.1uF  [footprint_52c0]  53.59 21.74 90 top
C5  1uF  [C0603]  41.86 40.28 0 top
C6  0.1uF  [footprint_52c0]  22.35 42.93 90 top
C7  0.1uF  [footprint_52c0]  45.97 21.79 90 top
C8  10uF  [footprint_52c0]  41.6 5.89 180 top
C9  10uF  [footprint_52c0]  21.79 3.56 90 top
C10  10uF  [footprint_52c0]  27.15 5.56 0 top
C11  10uF  [footprint_52c0]  27.33 11.33 270 top
C12  22uF  [footprint_52c0]  35.94 20.52 180 top
C13  10uF  [footprint_52c0]  41.6 7.72 180 top
C14  10uF  [footprint_52c0]  12.27 11.02 0 top
C15  0.1uF  [footprint_52c0]  89.03 35.28 90 top
C16  0.1uF  [footprint_52c0]  98.91 25.4 90 top
C17  0.1uF  [footprint_52c0]  89.03 15.52 90 top
C18  0.1uF  [footprint_52c0]  79.15 25.4 90 top
C19  0.1uF  [footprint_52c0]  8.79 31.09 0 top
C20  0.1uF  [footprint_52c0]  27.74 24.61 270 top
C21  0.1uF  [footprint_52c0]  16.38 14.81 0 top
D1  1N5819HW-7-F  [footprint_34dc]  40.72 2.67 270 top
D2  LESD5D5.0CT1G  [footprint_baa1]  42.62 2.08 270 top
D3  LESD5D5.0CT1G  [footprint_baa1]  50.01 10.16 0 top
D4  LESD5D5.0CT1G  [footprint_baa1]  52.6 10.16 180 top
D5  1N5819HW-7-F  [footprint_34dc]  35.05 17.5 270 top
D6  1N5819HW-7-F  [footprint_34dc]  19.61 9.04 90 top
LED1  KT-0603R  [footprint_1124]  33.22 11.2 270 top
LED3  XL-1608UGC-04  [footprint_5fac]  31.34 11.3 90 top
LED4  XL-1608UBC-04  [LED0603-RD_BLUE]  42.77 32.56 0 top
LED5  XL-1608UBC-04  [LED0603-RD_BLUE]  42.77 30.76 0 top
LED6  XL-1608UYC-06  [LED0603-RD-YELLOW]  84.46 39.37 180 top
LED7  XL-1608UYC-06  [LED0603-RD-YELLOW]  84.46 31.19 0 top
LED8  XL-1608SURC-06  [LED0603-RD_RED]  94.34 29.46 180 top
LED9  XL-1608SURC-06  [LED0603-RD_RED]  94.34 21.34 0 top
LED10  XL-1608UGC-04  [LED0603-RD_GREEN]  84.46 19.61 180 top
LED11  XL-1608UGC-04  [LED0603-RD_GREEN]  84.46 11.48 0 top
LED12  19-218/BHC-ZL1M2QY/3T  [LED0603-R-RD_BLUE]  74.57 21.13 0 top
LED13  19-218/BHC-ZL1M2QY/3T  [LED0603-R-RD_BLUE]  74.57 29.67 180 top
Q1  DMP1045U-7  [footprint_aab3]  24.41 8.41 90 top
R1  10kΩ  [footprint_0432]  44.27 41.17 90 top
R2  5.1kΩ  [footprint_0432]  55.65 8.99 180 top
R3  5.1kΩ  [footprint_0432]  47.07 9.04 0 top
R4  2kΩ  [footprint_0432]  33.1 14.45 90 top
R5  100kΩ  [footprint_0432]  29.08 11.38 270 top
R6  10kΩ  [footprint_0432]  31.44 14.45 90 top
R8  2kΩ  [footprint_0432]  27 15.09 0 top
R9  5.1kΩ  [footprint_0432]  39.5 32.56 0 top
R10  5.1kΩ  [footprint_0432]  39.5 30.79 0 top
R11  165Ω  [R0603]  97.66 29.46 180 top
R12  165Ω  [R0603]  92.71 19.43 0 top
R13  165Ω  [R0603]  84.58 29.46 180 top
R14  165Ω  [R0603]  87.76 39.62 180 top
R15  165Ω  [R0603]  87.88 19.69 180 top
R16  165Ω  [R0603]  81.06 11.41 0 top
R17  130Ω  [R0603]  74.55 19.18 180 top
R18  130Ω  [R0603]  72.77 31.5 0 top
SW1  TS-1089S-02526  [footprint_4ab8]  58.42 20.32 90 top
SW2  TS-1089S-02526  [footprint_4ab8]  50.8 20.32 90 top
SW3  SKHHCWA010  [footprint_5a2e]  17.14 44.45 0 top
SW4  TS-1089S-02526  [footprint_4ab8]  43.18 20.32 90 top
SW5  SK-3296S-01-L1  [SW-SMD_3P-P1.50_L2.7-W6.6]  27.18 2.34 0 top
SW6  SKHHCWA010  [footprint_5a2e]  84.46 35.28 0 top
SW7  SKHHCWA010  [footprint_5a2e]  94.34 25.4 0 top
SW8  SKHHCWA010  [footprint_5a2e]  84.46 15.52 0 top
SW9  SKHHCWA010  [footprint_5a2e]  74.57 25.4 0 top
SW11  RKJXV1224005  [SW-TH_RKJXV1224005]  16.36 24.21 270 top
U1  2.4GHz  [WIRELM-SMD_ESP32-S3-WROOM-1]  59.79 34.34 0 top
U2  S2B-PH-K-S(LF)(SN)  [footprint_2180]  12.19 9.25 180 top
U3  AZ1117H-3.3TRG1  [footprint_7102]  38.41 12.9 270 top
U4  MCP73831T-2ACI/OT  [footprint_d70e]  24.41 12.34 270 top
USB1  USB-TYPE-C-018  [footprint_530a]  50.8 3.94 0 top

## Footprints (pads in the part's own frame, mm; a bottom-side part is the same pattern mirrored in y, then rotated)
C0603
  rect 0.8x0.9 smd: 1(-0.7,0) 2(0.7,0)
footprint_4ab8
  rect 1.3x0.7 smd: 1(-2.25,1.075) 2(2.25,1.075) 3(-2.25,-1.075) 4(2.25,-1.075)
footprint_5a2e
  round 1.8 hole 1.2: 1(-3.25,2.25) 2(3.25,2.25) 3(-3.25,-2.25) 4(3.25,-2.25)
footprint_5fac
  rect 0.8x0.8 smd: 1(-0.799,-0.004) 2(0.799,0.004)
footprint_34dc
  rect 0.91x1.22 smd: 1(-1.635,0) 2(1.635,0)
footprint_52c0
  rect 0.8x0.9 smd: 1(-0.7,0) 2(0.7,0)
footprint_0432
  rect 0.806x0.864 smd: 1(-0.753,0) 2(0.753,0)
footprint_530a
  oval 1.2x2 hole 0.8x1.6: 0(-4.325,1.706) 1(4.325,1.706)
  oval 1.2x1.8 hole 0.8x1.4: 2(4.325,-2.474) 3(-4.325,-2.474)
  rect 0.3x1.3 smd: A1(-3.35,2.474) A4(-2.55,2.474) A5(-1.25,2.474) A6(-0.25,2.474) A7(0.25,2.474) A8(1.25,2.474) A9(2.55,2.474) A12(3.35,2.474) B1(3.05,2.474) B4(2.25,2.474) B5(1.75,2.474) B6(0.75,2.474) B7(-0.75,2.474) B8(-1.75,2.474) B9(-2.25,2.474) B12(-3.05,2.474)
footprint_1124
  rect 0.8x0.8 smd: 1(-0.799,-0.004) 2(0.799,0.004)
footprint_2180
  rect 1.5x1.4 hole 0.85: 1(1,0)
  round 1.4 hole 0.85: 2(-1,0)
footprint_7102
  rect 2.5x1.1 smd: 1(2.97,-2.3) 2(2.97,0) 3(2.97,2.3)
  rect 2.34x3.6 smd: 4(-2.97,0)
footprint_aab3
  rect 1.25x0.7 smd: 1(1,-0.95) 2(1,0.95) 3(-1,0)
footprint_baa1
  rect 0.6x0.4 smd: 1(-0.75,0) 2(0.75,0)
footprint_d70e
  rect 0.49x1.157 smd: 1(-0.95,-1.153) 2(0,-1.153) 3(0.95,-1.153)
  rect 0.49x1.175 smd: 4(0.95,1.153) 5(-0.95,1.153)
LED0603-R-RD_BLUE
  rect 0.8x0.8 smd: 1(0.851,0) 2(-0.851,0)
LED0603-RD-YELLOW
  rect 0.8x0.8 smd: 1(-0.799,-0.004) 2(0.799,0.004)
LED0603-RD_BLUE
  rect 0.8x0.8 smd: 1(-0.799,-0.004) 2(0.799,0.004)
LED0603-RD_GREEN
  rect 0.8x0.8 smd: 1(-0.799,-0.004) 2(0.799,0.004)
LED0603-RD_RED
  rect 0.8x0.8 smd: 1(-0.799,-0.004) 2(0.799,0.004)
R0603
  rect 0.806x0.864 smd: 1(-0.753,0) 2(0.753,0)
SW-SMD_3P-P1.50_L2.7-W6.6
  rect 1x1 smd: 0(-3.8,0.641) 0(-3.8,-1.559) 0(3.8,0.641) 0(3.8,-1.559)
  rect 1x1.4 smd: 1(-2.25,1.559) 2(0.75,1.559) 3(2.25,1.559)
SW-TH_RKJXV1224005
  round 1.8 hole 1.2: 1(7.527,-1.719) 2(7.527,0.781) 3(7.527,3.281) 4(1.298,9.511) 5(-1.202,9.511) 6(-3.703,9.511)
  round 2.5 hole 1.8: 7(-7.527,5.781) 8(-7.527,-4.219) 9(5.122,-4.219) 10(5.122,5.781)
  round 2.2 hole 1.6: a(-4.721,-5.011) b(-4.721,-9.511) c(2.279,-5.011) d(2.279,-9.511)
WIRELM-SMD_ESP32-S3-WROOM-1
  rect 1.5x0.9 smd: 1(-8.75,8.895) 2(-8.75,7.625) 3(-8.75,6.355) 4(-8.75,5.085) 5(-8.75,3.815) 6(-8.75,2.545) 7(-8.75,1.275) 8(-8.75,0.005) 9(-8.75,-1.265) 10(-8.75,-2.535) 11(-8.75,-3.805) 12(-8.75,-5.075) 13(-8.75,-6.345) 14(-8.75,-7.615) 27(8.75,-7.615) 28(8.75,-6.345) 29(8.75,-5.075) 30(8.75,-3.805) 31(8.75,-2.535) 32(8.75,-1.265) 33(8.75,0.005) 34(8.75,1.275) 35(8.75,2.545) 36(8.75,3.815) 37(8.75,5.085) 38(8.75,6.355) 39(8.75,7.625) 40(8.75,8.895)
  rect 0.9x1.5 smd: 15(-6.985,-8.895) 16(-5.715,-8.895) 17(-4.445,-8.895) 18(-3.175,-8.895) 19(-1.905,-8.895) 20(-0.635,-8.895) 21(0.635,-8.895) 22(1.905,-8.895) 23(3.175,-8.895) 24(4.445,-8.895) 25(5.715,-8.895) 26(6.985,-8.865)
  rect 0.9x0.9 smd: 41(-2.9,2.575) 41(-2.9,1.175) 41(-2.9,-0.225) 41(-1.5,2.575) 41(-1.5,1.175) 41(-1.5,-0.225) 41(-0.1,2.575) 41(-0.1,1.175) 41(-0.1,-0.225)

## Nets
As in the schematic.

Pads without a net: SW1 2 3; SW2 2 3; SW3 2 3; SW4 2 3; SW5 0 3; SW6 2 3; SW7 2 3; SW8 2 3; SW9 2 3; SW11 7 8 9 10 a d; U1 11 12 15 16 17 18 19 20 21 22 23 24 25 26 28 29 30 31 36 37 38 39; USB1 0 1 2 3 A8 B8

## Via types
v1: diameter 0.61, hole 0.305, Top Layer to Bottom Layer, 112 vias
v2: diameter 1.625, hole 0.813, Top Layer to Bottom Layer, 7 vias

## Routing (per net, layer and track width the routed paths; a pad name or vN(x,y) marks a point on that pad's centre or on a via; arc(x,y) is an arc through that point)
3V3: length 170.7
  Top Layer w0.762: 35.05,21.23 28.33,27.95 25.87,27.95 ; LED11.2 85.25,12.28 83.66,13.88 LED10.2 82.13,21.13 LED12.1 75.43,22.24 73.72,23.94 LED13.1 71.55,29.67 v2(71.5,29.72) ; 19.68,16.68 23.13,16.68 25.65,19.2 34.99,19.2 D5.1 ; v2(81.94,41.96) 83.66,40.25 LED6.2 83.66,34.58 85.22,33.02 85.22,31.23 LED7.2 85.72,30.73 92.26,30.73 LED8.2 93.54,26.86 95.13,25.26 LED9.2 ; 53.03,41.97 U1.2 42.87,41.97 42.72,42.11
  Top Layer w1.524: C12.2 35.05,20.71 v2(35.05,35.97) ; v2(35.05,40.23) 36.93,42.11 42.72,42.11 ; v2(64.82,41.97) 53.03,41.97 ; D5.1 35.05,20.51 35.06,20.52
  Bottom Layer w1.524: 66.49,41.97 81.94,41.97 v2(81.94,41.96) ; 66.49,41.97 v2(64.82,41.97) ; 66.49,41.97 71.5,36.96 v2(71.5,29.72) ; v2(35.05,35.97) v2(35.05,40.23)
GND:
  vias: v1(3.25,40.59) v1(3.25,39.32) v1(3.25,38.05) v1(4.52,40.59) v1(4.52,39.32) v1(4.52,38.05) v1(4.93,16.21) v1(4.93,14.94) v1(4.93,13.67) v1(5.79,40.59) v1(5.79,39.32) v1(5.79,38.05) v1(6.2,16.21) v1(6.2,14.94) v1(6.2,13.67) v1(7.47,16.21) v1(7.47,14.94) v1(7.47,13.67) v1(17.32,6.83) v1(18.92,1.98) v1(21.87,14.55) v1(22.71,6.22) v1(24.64,15.27) v1(25.55,46.53) v1(25.55,45.26) v1(25.55,43.99) v1(26.82,46.53) v1(26.82,45.26) v1(26.82,43.99) v1(27.14,7.05) v1(28.09,46.53) v1(28.09,45.26) v1(28.09,43.99) v1(29.16,32.56) v1(29.16,31.29) v1(29.16,30.02) v1(29.69,14.76) v1(30.12,11.46) v1(30.43,32.56) v1(30.43,31.29) v1(30.43,30.02) v1(31.7,32.56) v1(31.7,31.29) v1(31.7,30.02) v1(32.46,17.75) v1(32.77,2.01) v1(35.64,13) v1(37.59,7.59) v1(37.59,3.63) v1(38.46,27.58) v1(38.46,26.31) v1(38.46,25.04) v1(39.73,27.58) v1(39.73,26.31) v1(39.73,25.04) v1(41,27.58) v1(41,26.31) v1(41,25.04) v1(43.81,9.46) v1(43.81,4.37) v1(65.53,12.95) v1(65.53,11.68) v1(65.53,10.41) v1(66.8,12.95) v1(66.8,11.68) v1(66.8,10.41) v1(68.07,12.95) v1(68.07,11.68) v1(68.07,10.41) v1(78.74,47.45) v1(78.74,46.18) v1(78.74,44.91) v1(80.01,47.45) v1(80.01,46.18) v1(80.01,44.91) v1(81.28,47.45) v1(81.28,46.18) v1(81.28,44.91) v1(81.74,5.39) v1(81.74,4.12) v1(81.74,2.85) v1(83.01,5.39) v1(83.01,4.12) v1(83.01,2.85) v1(84.28,5.39) v1(84.28,4.12) v1(84.28,2.85) v1(94.44,15.24) v1(94.44,13.97) v1(94.44,12.7) v1(94.84,37.34) v1(94.84,36.07) v1(94.84,34.8) v1(95.71,15.24) v1(95.71,13.97) v1(95.71,12.7) v1(96.11,37.34) v1(96.11,36.07) v1(96.11,34.8) v1(96.98,15.24) v1(96.98,13.97) v1(96.98,12.7) v1(97.38,37.34) v1(97.38,36.07) v1(97.38,34.8)
VBAT: length 6.9
  Top Layer w0.762: 24.88,3.9 24.52,4.26 C9.2
  Top Layer w1.524: 21.25,4.46 19.61,6.1 D6.1
VBUS: length 49.4
  Top Layer w0.254: 52.58,5.08 53.09,5.59 53.09,6.41 53.22,6.41 ; USB1.A4 48.51,6.41 48.51,5.63 49.02,5.12 49.02,4.7
  Top Layer w0.762: v2(34.19,8.48) 33.23,9.45 33.23,10.4 ; 49.02,4.7 47.75,3.43 ; Q1.1 26.28,8.48 ; 31.4,8.48 29.25,10.63 C11.2 26.33,10.63 25.56,11.39
  Top Layer w1.524: v2(34.19,8.48) 26.28,8.48 ; 52.32,4.57 51.18,3.43 45.72,3.43 43.32,1.03 D1.2 37.32,1.03 v2(34.62,3.73)
  Bottom Layer w1.524: v2(34.19,8.48) 34.62,8.05 v2(34.62,3.73)
VCC_5V: length 20.9
  Top Layer w0.762: 27.88,3.9 27.88,5.59
  Top Layer w1.524: C10.2 28.12,5.83 39.19,5.83 D1.1 ; U3.3 40.71,4.37
B1: length 22.9
  Top Layer w0.254: SW6.4 89.03,34.35 C15.1 ; U1.35 68.9,36.89 70.09,35.7 74.18,35.7 74.67,35.2 v1(82.19,35.2)
  Bottom Layer w0.254: v1(82.19,35.2) 85.53,35.2 SW6.4
B2: length 37.2
  Top Layer w0.254: SW7.4 98.91,24.47 C16.1 ; v1(93.68,24.79) 82.92,24.79 81.46,26.25 81.46,27.85 74.01,35.29 69.92,35.29 69.6,35.62 U1.34
  Bottom Layer w0.254: SW7.4 95.94,24.79 v1(93.68,24.79)
B3: length 35
  Top Layer w0.254: C17.1 89.03,14.59 SW8.4 ; U1.33 69.6,34.35 70.14,34.89 73.84,34.89 81.05,27.68 81.05,26.09 v1(86.31,20.83)
  Bottom Layer w0.254: v1(86.31,20.83) 86.31,14.67 SW8.4
B4: length 21.3
  Top Layer w0.254: 79.15,24.47 80.65,25.97 80.65,27.51 73.67,34.48 70.31,34.48 68.9,33.08 U1.32 ; 79.15,24.47 SW9.4 ; 79.15,24.47 C18.1
B5: length 49.5
  Top Layer w0.254: U1.7 50.33,35.62 49.99,35.96 49.99,37.01 49.65,37.34 27.92,37.34 27.57,36.99 24.8,36.99 22,34.19 11.19,34.19 C19.1 8.09,30.17 SW11.b
BOOT: length 13.8
  Top Layer w0.254: U1.27 68.58,26.69 68.58,23.77 65.85,21.04 C1.1 59.69,22.57 59.5,22.57
CC1: length 4
  Top Layer w0.254: R3.2 49,9.04 49.56,8.48 49.56,6.42 USB1.A5
CC2: length 4.5
  Top Layer w0.254: USB1.B5 52.55,8.2 53.37,9.02 54.87,9.02 R2.2
CHIP_PU: length 31.6
  Top Layer w0.254: v1(52.78,23.83) 51.88,22.92 SW2.4 51.87,22.56 51.87,21.44 52.26,21.04 C4.1 ; v1(52.38,40.64) 52.32,40.7 U1.3 50.09,40.7 49.68,40.28 C5.2
  Bottom Layer w0.254: v1(52.78,23.83) 52.78,40.23 v1(52.38,40.64)
D+: length 27.2
  Top Layer w0.254: U1.14 50.16,26.73 49.73,27.16 49.61,27.16 47.84,25.39 47.84,17.71 51.5,14.04 51.5,7.24 51.55,7.19 USB1.B6 51.51,6.37 51.51,5.68 51.29,5.46 50.81,5.46 50.55,5.72 USB1.A6
D-: length 27.2
  Top Layer w0.254: USB1.A7 51.05,7.19 51.1,7.24 ; 51.1,7.24 51.1,13.88 47.43,17.54 47.43,25.56 49.44,27.56 49.73,27.56 50.16,28 U1.13 ; 51.1,7.24 50.99,7.34 50.2,7.34 50.05,7.19 USB1.B7
JS_X: length 51.3
  Top Layer w0.254: v1(27.33,38.15) 27.34,38.16 U1.5 ; 17.14,16.68 17.08,16.62 C21.2
  Bottom Layer w0.254: v1(27.33,38.15) 27.33,33.63 19.89,26.19 19.89,19.43 17.14,16.68
JS_Y: length 40.9
  Top Layer w0.254: SW11.5 27.64,25.41 C20.1 ; U1.4 50.68,39.43 49.82,38.56 28.14,38.56 v1(27.94,38.76)
  Bottom Layer w0.254: SW11.5 24.41,26.87 24.41,30.13 27.74,33.46 27.74,37.69 27.94,37.9 v1(27.94,38.76)
LED1: length 8.2
  Top Layer w0.254: U1.8 50.45,34.35 49.94,33.84 46.07,33.84 44.8,32.57 LED4.2
LED2: length 8.7
  Top Layer w0.254: U1.9 50.34,33.08 49.98,33.43 46.24,33.43 LED5.2
PAIR: length 16.5
  Top Layer w0.254: U1.10 50.99,31.75 48.41,31.75 44.25,27.59 SW4.4 44.25,22.56 44.25,21.54 44.69,21.09 C7.1
PILOT: length 33.1
  Top Layer w0.254: U1.6 50.68,36.89 49.82,37.75 27.75,37.75 27.47,37.47 27.11,37.47 C6.1 22.33,42.2 SW3.4
$2N1130: length 2.1
  Top Layer w0.254: 25.56,13.29 25.56,14.4 26.25,15.09
$2N1131: length 12.6
  Top Layer w0.254: R6.2 30.45,16.21 24.21,16.21 23.26,15.25 U4.1
  Top Layer w0.635: R4.2 R6.2
$2N1132: length 18.1
  Top Layer w0.635: U4.3 23.68,11.39 24.41,10.67 Q1.3
  Top Layer w0.762: 20.8,12.67 22.08,11.39 U4.3
  Top Layer w1.524: 20.8,12.67 14.2,12.67 13.19,11.67 U2.2
$2N1133: length 1.6
  Top Layer w0.254: LED3.2 31.44,12.21 R6.1
$2N1135: length 1.7
  Top Layer w0.254: LED1.1 33.1,12.12 R4.1
$2N1136: length 4.4
  Top Layer w0.762: Q1.2 20.88,9.41 D6.2
$2N1158: length 9.3
  Top Layer w1.524: D5.2 38.4,15.87 U3.4 U3.2
$3N1382: length 1.7
  Top Layer w0.254: R9.2 41.97,32.56 LED4.1
$3N1428: length 1.7
  Top Layer w0.254: LED5.1 41.94,30.79 R10.2
$3N3146: length 1.8
  Top Layer w0.254: LED8.1 96.91,29.47 R11.2
$3N3185: length 1.9
  Top Layer w0.254: LED9.1 93.54,19.5 R12.2
$3N3261: length 1.8
  Top Layer w0.254: R13.2 83.66,29.64 LED7.1
$3N3300: length 1.9
  Top Layer w0.254: LED6.1 86.75,39.37 R14.2
$3N3339: length 1.9
  Top Layer w0.254: LED10.1 87.06,19.61 R15.2
$3N3378: length 1.9
  Top Layer w0.254: R16.2 83.59,11.41 LED11.1
$3N3417: length 2
  Top Layer w0.254: LED12.2 73.8,21.06 R17.2
$3N3456: length 3.1
  Top Layer w0.254: R18.2 74.29,31.5 75.43,30.37 LED13.2

## Copper pours and planes (outline as drawn; the poured copper is in the pictures)
GND on Top Layer: 0,50.8 101.6,50.8 101.6,0 0,0
GND on Bottom Layer: 0,50.8 101.6,50.8 101.6,0 0,0

## Text on the board
Top Silkscreen Layer: Designed by Broderick Riopelle | Y | X | SERIAL/PILOT | ON | OFF | PAIR | RESET | BOOT | B5 | B4 | B3 | B1 | B2 | MBot Command Link
